# Altium schematic sheet remote.SchDoc
size A2
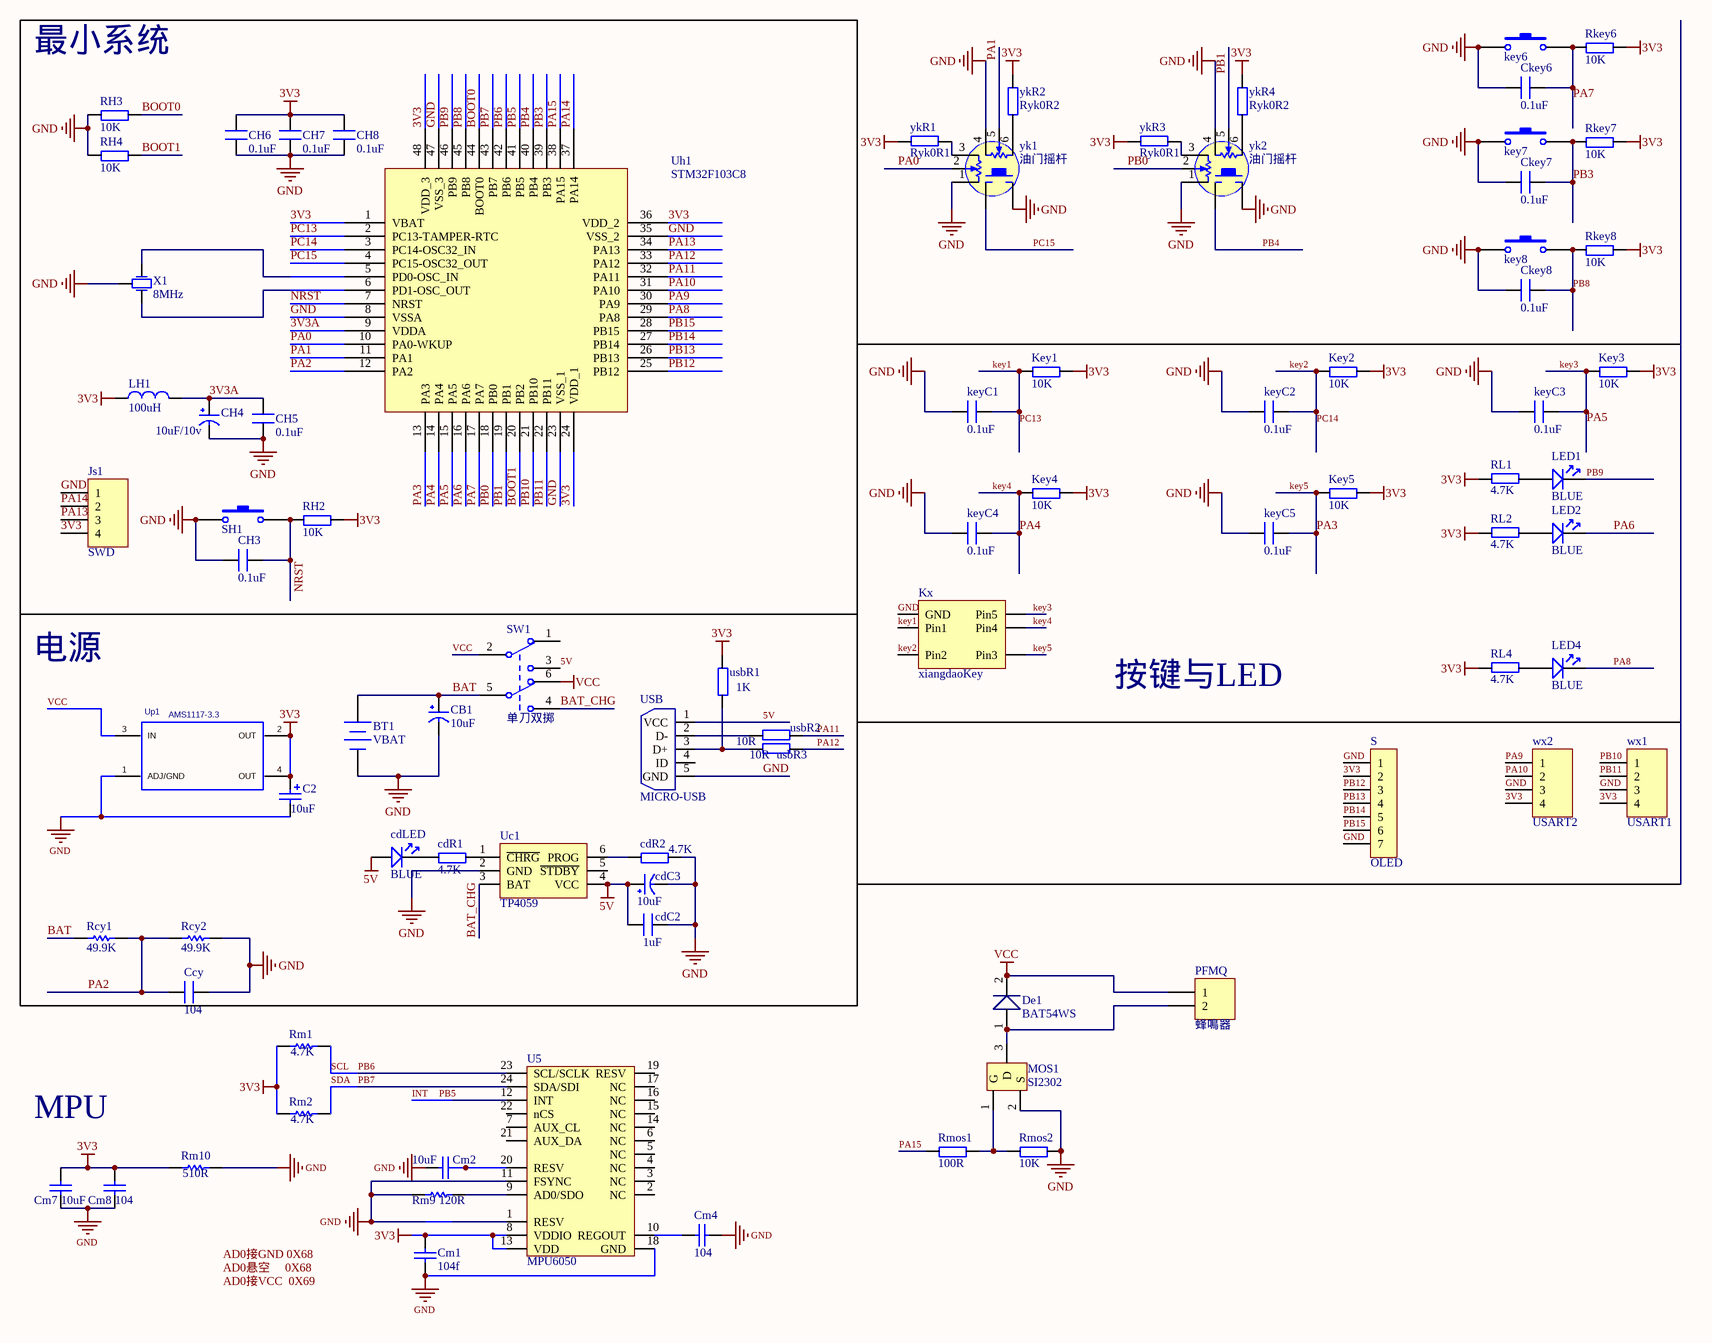
[diagram p0: remote.SchDoc]

## Parts
BT1  VBAT  [BAT-2]
C2  value 10uF  [C1206钽]  (hidden comment: Cap Pol2)
CB1  10uF  [C1206钽]
Ccy  104  [C0603]
cdC2  1uF  [C0603]
cdC3  10uF  [C0805 钽电容]
cdLED  BLUE  [L0603]
cdR1  4.7K  [R0603]
cdR2  4.7K  [R0603]
CH3  0.1uF  [C0603]
CH4  10uF/10v  [C0805 钽电容]
CH5  0.1uF  [C0603]
CH6  0.1uF  [C0603]
CH7  0.1uF  [C0603]
CH8  0.1uF  [C0603]
Ckey6  0.1uF  [C0603]
Ckey7  0.1uF  [C0603]
Ckey8  0.1uF  [C0603]
Cm1  value 104f  [C0603]  (hidden comment: Cap)
Cm2  value 10uF  [C0603]  (hidden comment: Cap)
Cm4  value 104  [C0603]  (hidden comment: Cap)
Cm7  value 10uF  [C0603]  (hidden comment: Cap)
Cm8  value 104  [C0603]  (hidden comment: Cap)
De1  BAT54WS  [SOD-323]
Js1  SWD  [1X4_1_25]
Key1  10K  [R0603]
Key2  10K  [R0603]
Key3  10K  [R0603]
Key4  10K  [R0603]
Key5  10K  [R0603]
key6  SW_PB  [KEY1]  (value not drawn)
key7  SW_PB  [KEY1]  (value not drawn)
key8  SW_PB  [KEY1]  (value not drawn)
keyC1  0.1uF  [C0603]
keyC2  0.1uF  [C0603]
keyC3  0.1uF  [C0603]
keyC4  0.1uF  [C0603]
keyC5  0.1uF  [C0603]
Kx  xiangdaoKey  [daohangKey]
LED1  BLUE  [L0603]
LED2  BLUE  [L0603]
LED4  BLUE  [L0603]
LH1  100uH  [0805]
MOS1  SI2302  [SO-G3/C2.5]
PFMQ  蜂鳴器  [FMQ_tp]
Rcy1  value 49.9K  [R0603]  (hidden comment: Res1)
Rcy2  value 49.9K  [R0603]  (hidden comment: Res1)
RH2  10K  [R0603]
RH3  10K  [R0603]
RH4  10K  [R0603]
Rkey6  10K  [R0603]
Rkey7  10K  [R0603]
Rkey8  10K  [R0603]
RL1  4.7K  [0603P]
RL2  4.7K  [R0603]
RL4  4.7K  [R0603]
Rm1  value 4.7K  [R0603]  (hidden comment: Res1)
Rm2  value 4.7K  [R0603]  (hidden comment: Res1)
Rm9  value 120R  [R0603]  (hidden comment: Res1)
Rm10  value 510R  [R0603]  (hidden comment: Res1)
Rmos1  100R  [0603P]
Rmos2  10K  [0603P]
S  OLED  [HDR1X7_2.54]
SH1  SW_PB  [KEY1]  (value not drawn)
SW1  单刀双掷  [拨动开关DIP]
U5  MPU6050  [QFN24]
Uc1  TP4059  [SOT23-6S]
Uh1  STM32F103C8  [LQFP48_M]
Up1  AMS1117-3.3  [LC-SOT-223]
USB  MICRO-USB  [MICRO_USB5P_SOP]
usbR1  1K  [R0603]
usbR2  10R  [R0603]
usbR3  10R  [R0603]
wx1  USART1  [HDR1X4]
wx2  USART2  [HDR1X4]
X1  8MHz  [XTAL3215]
yk1  油门摇杆  [摇杆A]
yk2  油门摇杆  [摇杆A]
ykR1  Ryk0R1  [R0603]
ykR2  Ryk0R2  [R0603]
ykR3  Ryk0R1  [R0603]
ykR4  Ryk0R2  [R0603]

## Blocks framed on the sheet
最小系统: CH3-CH8 Js1 LH1 RH2-RH4 SH1 Uh1 X1
电源: BT1 C2 CB1 Ccy cdC2 cdC3 cdLED cdR1 cdR2 Rcy1 Rcy2 SW1 Uc1 Up1 USB usbR1-usbR3

## Nets
3V3: C2.1 CH6.2 CH7.2 CH8.2 Cm1.2 Cm7.2 Cm8.2 Js1.4 Key1.2 Key2.2 Key3.2 Key4.2 Key5.2 LH1.1 RH2.2 Rkey6.2 Rkey7.2 Rkey8.2 RL1.2 RL2.2 RL4.2 Rm1.2 Rm2.2 Rm10.2 S.2 U5.8(VDDIO) U5.13(VDD) Uh1.1(VBAT) Uh1.24(VDD_1) Uh1.36(VDD_2) Uh1.48(VDD_3) Up1.2(OUT) Up1.4(OUT) usbR1.2 wx1.4 wx2.4 ykR1.2 ykR2.2 ykR3.2 ykR4.2
5V: cdC2.1 cdC3.1(VCC) cdLED.1 SW1.3 Uc1.4(VCC) USB.1(VCC)
GND: BT1.2(-) C2.2 CB1.2(GND) Ccy.2 cdC2.2 cdC3.2(GND) cdR2.2 CH3.1 CH4.2(GND) CH5.1 CH6.1 CH7.1 CH8.1 Ckey6.1 Ckey7.1 Ckey8.1 Cm1.1 Cm2.1 Cm4.1 Cm7.1 Cm8.1 Js1.1 key6.1 key7.1 key8.1 keyC1.1 keyC2.1 keyC3.1 keyC4.1 keyC5.1 Kx.1(GND) MOS1.2(S) Rcy2.2 RH3.1 RH4.1 Rm9.2 Rm10.1 Rmos2.2 S.1 S.7 SH1.1 U5.1(RESV) U5.11(FSYNC) U5.18(GND) Uc1.2(GND) Uh1.8(VSSA) Uh1.23(VSS_1) Uh1.35(VSS_2) Uh1.47(VSS_3) Up1.1(ADJ/GND) USB.5(GND) wx1.3 wx2.3 X1.2(GND) yk1.1 yk1.4 yk1.J1 yk2.1 yk2.4 yk2.J1
VCC: De1.2 PFMQ.1 SW1.2 SW1.6 Up1.3(IN)
3V3A: CH4.1(VCC) CH5.2 LH1.2 Uh1.9(VDDA)
BAT: BT1.1(+) CB1.1(VCC) Rcy1.1 SW1.5
BAT_CHG: SW1.4 Uc1.3(BAT)
BOOT0: RH3.2 Uh1.44(BOOT0)
BOOT1: RH4.2 Uh1.20(PB2)
INT: U5.12(INT) Uh1.41(PB5)  [also labelled PB5]
key1: Key1.1 keyC1.2 Kx.2(Pin1) Uh1.2(PC13-TAMPER-RTC)  [also labelled PC13]
key2: Key2.1 keyC2.2 Kx.3(Pin2) Uh1.3(PC14-OSC32_IN)  [also labelled PC14]
key3: Key3.1 keyC3.2 Kx.6(Pin5) Uh1.15(PA5)  [also labelled PA5]
key4: Key4.1 keyC4.2 Kx.5(Pin4) Uh1.14(PA4)  [also labelled PA4]
key5: Key5.1 keyC5.2 Kx.4(Pin3) Uh1.13(PA3)  [also labelled PA3]
NRST: CH3.2 RH2.1 SH1.2 Uh1.7(NRST)
PA0: Uh1.10(PA0-WKUP) yk1.2
PA1: Uh1.11(PA1) yk1.5
PA2: Ccy.1 Rcy1.2 Rcy2.1 Uh1.12(PA2)
PA6: LED2.2 Uh1.16(PA6)
PA7: Ckey6.2 key6.2 Rkey6.1 Uh1.17(PA7)
PA8: LED4.2 Uh1.29(PA8)
PA9: Uh1.30(PA9) wx2.1
PA10: Uh1.31(PA10) wx2.2
PA11: Uh1.32(PA11) usbR2.1
PA12: Uh1.33(PA12) usbR3.1
PA13: Js1.3 Uh1.34(PA13)
PA14: Js1.2 Uh1.37(PA14)
PA15: Rmos1.1 Uh1.38(PA15)
PB0: Uh1.18(PB0) yk2.2
PB1: Uh1.19(PB1) yk2.5
PB3: Ckey7.2 key7.2 Rkey7.1 Uh1.39(PB3)
PB4: Uh1.40(PB4) yk2.J2
PB6: Rm1.1 U5.23(SCL/SCLK) Uh1.42(PB6)  [also labelled SCL]
PB7: Rm2.1 U5.24(SDA/SDI) Uh1.43(PB7)  [also labelled SDA]
PB8: Ckey8.2 key8.2 Rkey8.1 Uh1.45(PB8)
PB9: LED1.2 Uh1.46(PB9)
PB10: Uh1.21(PB10) wx1.1
PB11: Uh1.22(PB11) wx1.2
PB12: S.3 Uh1.25(PB12)
PB13: S.4 Uh1.26(PB13)
PB14: S.5 Uh1.27(PB14)
PB15: S.6 Uh1.28(PB15)
PC15: Uh1.4(PC15-OSC32_OUT) yk1.J2
NetcdLED_2: cdLED.2 cdR1.1
NetcdR1_2: cdR1.2 Uc1.1(~{CHRG})
NetcdR2_1: cdR2.1 Uc1.6(PROG)
NetCm2_2: Cm2.2 U5.20(RESV)
NetCm4_2: Cm4.2 U5.10(REGOUT)
NetDe1_1: De1.1 MOS1.3(D) PFMQ.2
NetLED1_1: LED1.1 RL1.1
NetLED2_1: LED2.1 RL2.1
NetLED4_1: LED4.1 RL4.1
NetMOS1_1: MOS1.1(G) Rmos1.2 Rmos2.1
NetRm9_1: Rm9.1 U5.9(AD0/SDO)
NetUh1_5: Uh1.5(PD0-OSC_IN) X1.1(OSC1)
NetUh1_6: Uh1.6(PD1-OSC_OUT) X1.3(OSC2)
NetUSB_2: USB.2(D-) usbR2.2
NetUSB_3: USB.3(D+) usbR1.1 usbR3.2
Netyk1_3: yk1.3 ykR1.1
Netyk1_6: yk1.6 ykR2.1
Netyk2_3: yk2.3 ykR3.1
Netyk2_6: yk2.6 ykR4.1

Not connected (* = marked no-connect by the designer): SW1 1; U5 2(NC) 3(NC) 4(NC) 5(NC) 6(NC) 7(AUX_CL) 14(NC) 15(NC) 16(NC) 17(NC) 19(RESV) 21(AUX_DA) 22(nCS); Uc1 5(~{STDBY}); USB 4(ID)

## Notes on the sheet
- 按键与LED
- MPU
- AD0接GND 0X68
- AD0悬空     0X68
- AD0接VCC  0X69

## Library data of the parts
BT1 = Battery: Multicell Battery; Published: 24-Mar-1999; LatestRevisionDate: 17-Jul-2002; LatestRevisionNote: Re-released for DXP Platform.; PackageReference: BAT-2; Publisher: Altium Limited
C2 = Cap Pol2: Polarized Capacitor (Axial); Published: 8-Jun-2000; LatestRevisionDate: 17-Jul-2002; LatestRevisionNote: Re-released for DXP Platform.; PackageReference: POLAR0.8; Publisher: Altium Limited; PackageDescription: Polarized Capacitor; 2 Leads
CB1 cdC3 CH4 = CAP
Ccy cdC2 CH3 CH5-CH8 Ckey6-Ckey8 keyC1-keyC5 = C
cdLED LED1 LED2 LED4 = LED
cdR1 cdR2 Key1-Key5 RH2-RH4 Rkey6-Rkey8 RL1 RL2 RL4 Rmos1 Rmos2 usbR1-usbR3 ykR1-ykR4 = R
Cm1 Cm2 Cm4 Cm7 Cm8 = Cap: Capacitor; Published: 8-Jun-2000; LatestRevisionDate: 17-Jul-2002; LatestRevisionNote: Re-released for DXP Platform.; PackageReference: RAD-0.3; Publisher: Altium Limited; PackageDescription: Radial Cap, Thru-Hole; 2 Leads; 0.3 in Pin Spacing
De1 = BAT54: 单肖特基二极管
Js1 = Header, 1*4-Pin: LatestRevisionDate: 17-Jul-2002; LatestRevisionNote: Re-released for DXP Platform.; Publisher: Altium Limited
key6-key8 SH1 = KEY_DT: Published: 24-Mar-1999; LatestRevisionDate: 17-Jul-2002; LatestRevisionNote: Re-released for DXP Platform.; PackageReference: SPST-2; Publisher: Altium Limited; PackageDescription: Switch; 2 Leads
Kx = XD_Key
LH1 = LS1
MOS1 = MOS-N: AP2306
PFMQ = Header 2: Header, 2-Pin; LatestRevisionDate: 17-Jul-2002; LatestRevisionNote: Re-released for DXP Platform.; Publisher: Altium Limited
Rcy1 Rcy2 Rm1 Rm2 Rm9 Rm10 = Res1: Resistor; Published: 8-Jun-2000; LatestRevisionDate: 17-Jul-2002; LatestRevisionNote: Re-released for DXP Platform.; PackageReference: AXIAL-0.3; Publisher: Altium Limited; PackageDescription: Axial Device, Thru-Hole; 2 Leads; 0.3 in Pin Spacing
S = Header 1X7_2_54: 7pin2_54mm
SW1 = 单刀双掷开关
U5 = MPU9250: 9轴运动处理传感器
Up1 = 1117-3.3: SOT-223; Manufacturer #1: SPX; Geometry.Height: 62.99mil; Manufacturer #1 PN: 1117-3.3
USB = USB5
wx1 wx2 = Header 4: Header, 4-Pin; LatestRevisionDate: 17-Jul-2002; LatestRevisionNote: Re-released for DXP Platform.; Publisher: Altium Limited
X1 = XTAL-3215
yk1 yk2 = 摇杆